# EAGLE design tester (EAGLE 6.4)
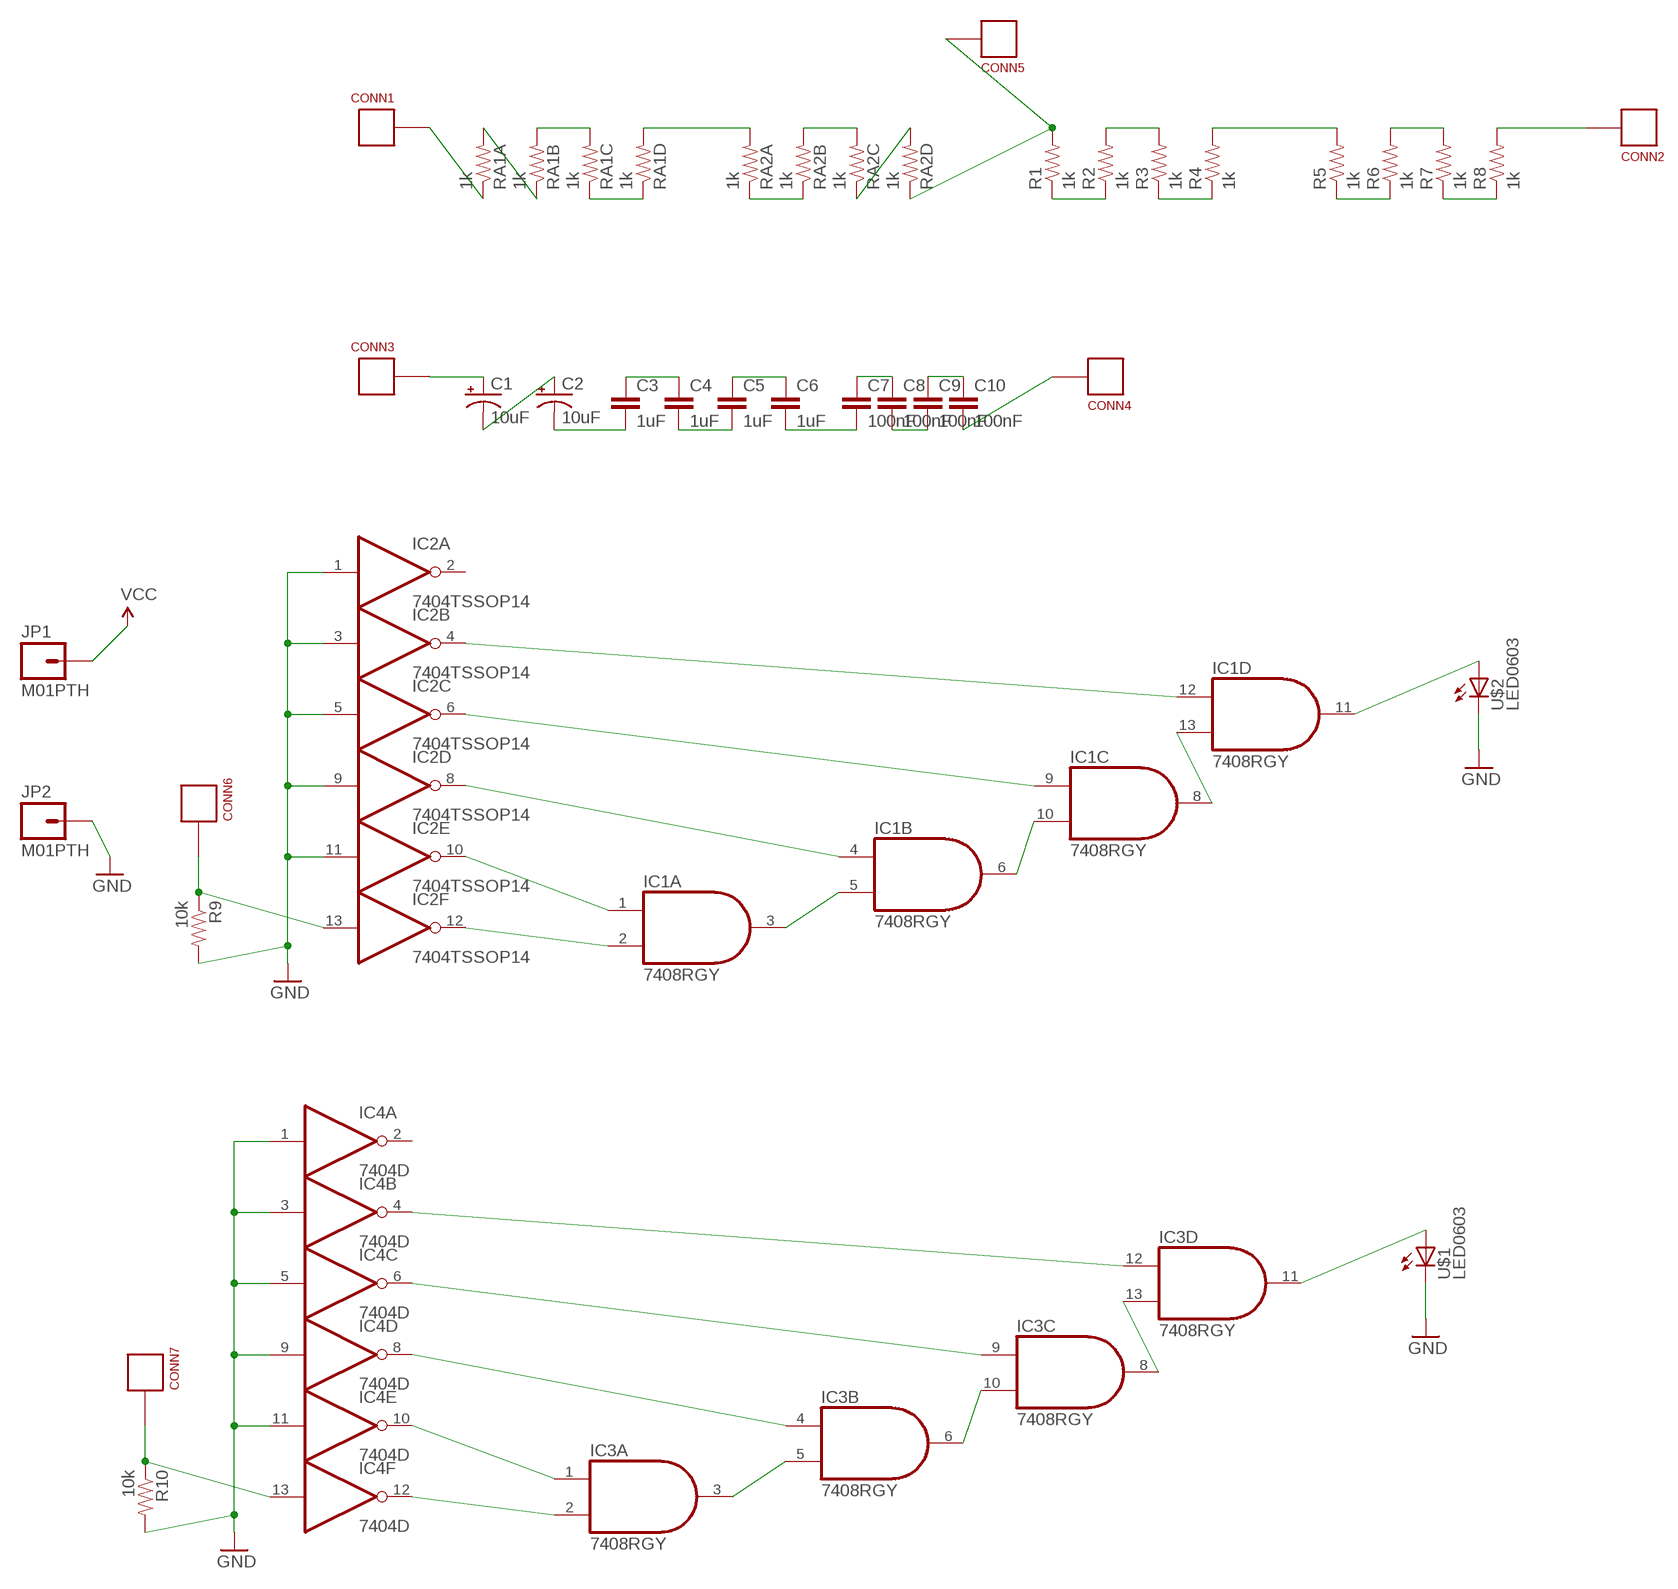
[diagram p0: schematic, sheet 1]

## Parts
C1  10uF  CAP_POL1206  [EIA3216]
C2  10uF  CAP_POL1206  [EIA3216]
C3  1uF  CAP0805  [0805]
C4  1uF  CAP0805  [0805]
C5  1uF  CAP0805  [0805]
C6  1uF  CAP0805  [0805]
C7  100nF  CAP0402-CAP  [0402-CAP]
C8  100nF  CAP0402-CAP  [0402-CAP]
C9  100nF  CAP0402-CAP  [0402-CAP]
C10  100nF  CAP0402-CAP  [0402-CAP]
CONN1  CONNECTOR  [TESTPAD]
CONN2  CONNECTOR  [TESTPAD]
CONN3  CONNECTOR  [TESTPAD]
CONN4  CONNECTOR  [TESTPAD]
CONN5  CONNECTOR  [TESTPAD]
CONN6  CONNECTOR  [TESTPAD]
CONN7  CONNECTOR  [TESTPAD]
IC1  7408RGY  [QFN14]
IC2  7404TSSOP14  [TSSOP14]
IC3  7408RGY  [QFN14]
IC4  7404D  [SO14]
JP1  M01PTH  [1X01]
JP2  M01PTH  [1X01]
R1  1k  RESISTOR0603  [0603-RES]
R2  1k  RESISTOR0603  [0603-RES]
R3  1k  RESISTOR0603  [0603-RES]
R4  1k  RESISTOR0603  [0603-RES]
R5  1k  RESISTOR0402  [0402-RES]
R6  1k  RESISTOR0402  [0402-RES]
R7  1k  RESISTOR0402  [0402-RES]
R8  1k  RESISTOR0402  [0402-RES]
R9  10k  RESISTOR0402  [0402-RES]
R10  10k  RESISTOR0402  [0402-RES]
RA1  1k  RESISTOR_ARRAY0603_X4  [0603-ARV]
RA2  1k  RESISTOR_ARRAY0603_X4  [0603-ARV]
U$1  LED0603  [0603_LED]
U$2  LED0603  [0603_LED]

## Nets
GND: IC2.1(A:I) IC2.3(B:I) IC2.5(C:I) IC2.9(D:I) IC2.11(E:I) IC4.1(A:I) IC4.3(B:I) IC4.5(C:I) IC4.9(D:I) IC4.11(E:I) JP2.1 R9.2 R10.2 U$1.C U$2.C
N$1: RA1.2 RA1.8
N$2: CONN1.P RA1.1
N$3: RA1.6 RA1.7
N$4: RA1.3 RA1.4
N$5: RA1.5 RA2.8
N$6: RA2.1 RA2.2
N$7: RA2.6 RA2.7
N$8: RA2.3 RA2.5
N$9: R1.1 R2.1
N$10: R2.2 R3.2
N$11: R3.1 R4.1
N$12: R4.2 R5.2
N$13: R5.1 R6.1
N$14: R6.2 R7.2
N$15: R7.1 R8.1
N$16: CONN2.P R8.2
N$17: CONN5.P R1.2 RA2.4
N$18: C1.A(+) CONN3.P
N$19: C1.C(-) C2.A(+)
N$20: C2.C(-) C3.2
N$21: C3.1 C4.1
N$22: C4.2 C5.2
N$23: C5.1 C6.1
N$24: C6.2 C7.2
N$25: C8.2 C9.2
N$26: C9.1 C10.1
N$27: C7.1 C8.1
N$28: C10.2 CONN4.P
N$29: IC1.2(A:I1) IC2.12(F:O)
N$30: IC1.1(A:I0) IC2.10(E:O)
N$31: IC1.4(B:I0) IC2.8(D:O)
N$32: IC1.3(A:O) IC1.5(B:I1)
N$33: IC1.6(B:O) IC1.10(C:I1)
N$34: IC1.9(C:I0) IC2.6(C:O)
N$35: IC1.12(D:I0) IC2.4(B:O)
N$36: IC1.8(C:O) IC1.13(D:I1)
N$37: IC1.11(D:O) U$2.A
N$38: IC3.3(A:O) IC3.5(B:I1)
N$39: IC3.6(B:O) IC3.10(C:I1)
N$40: IC3.8(C:O) IC3.13(D:I1)
N$41: IC3.11(D:O) U$1.A
N$42: IC3.2(A:I1) IC4.12(F:O)
N$43: IC3.1(A:I0) IC4.10(E:O)
N$44: IC3.9(C:I0) IC4.6(C:O)
N$45: IC3.4(B:I0) IC4.8(D:O)
N$46: IC3.12(D:I0) IC4.4(B:O)
N$47: CONN6.P IC2.13(F:I) R9.1
N$48: CONN7.P IC4.13(F:I) R10.1
VCC: JP1.1
Unconnected: IC2.2(A:O) IC4.2(A:O)

## Power pins joined to a net without a drawn wire
GND: IC1.7(P:GND) IC2.7(P:GND) IC3.7(P:GND) IC4.7(P:GND)
VCC: IC1.14(P:VCC) IC2.14(P:VCC) IC3.14(P:VCC) IC4.14(P:VCC)

## Library data of the parts
C1 C2 = kmod:CAP_POL: Capacitor Polarized These are standard SMD and PTH capacitors. Normally 10uF, 47uF, and 100uF in electrolytic and tantalum varieties. Always verify the external diameter of the through hole cap, it varies with capacity, voltage, and manufacturer. The EIA devices should be standard.
C3-C10 = SparkFun-Capacitors:CAP: Capacitor Standard 0603 ceramic capacitor, and 0.1" leaded capacitor.
CONN1-CONN7 = kmod:CONNECTOR
IC1 IC3 = kmod:74*08: Quad 2-input AND gate
IC2 IC4 = kmod:74*04: Hex INVERTER
JP1 JP2 = SparkFun-Connectors:M01: Header 1 Standard 1-pin 0.1" header. Use with straight break away headers (SKU : PRT-00116), right angle break away headers (PRT-00553), swiss pins (PRT-00743), machine pins (PRT-00117), and female headers (PRT-00115).
R1-R10 = kmod:RESISTOR: Resistor Basic schematic elements and footprints for 0603, 1206, and PTH resistors.
RA1 RA2 = kmod:RESISTOR_ARRAY
U$1 U$2 = kmod:LED

## Board
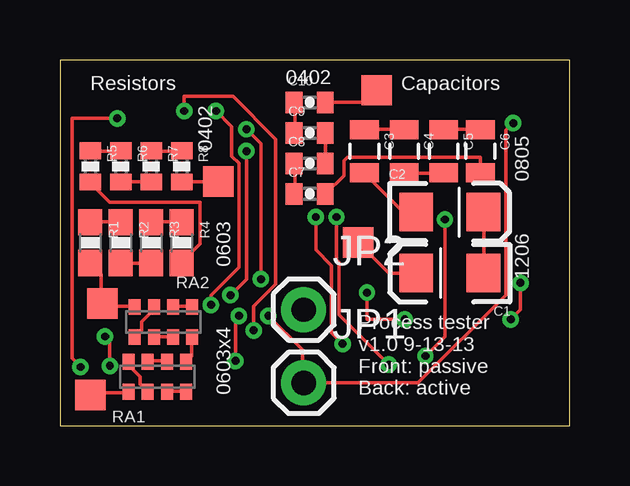
[diagram p1: board, top side]
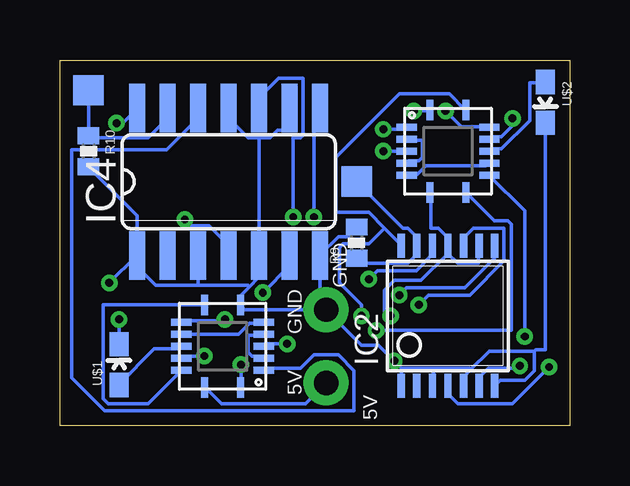
[diagram p2: board, bottom side, seen from below]

Size 21.26 x 15.23 mm. Coordinates in mm from the lower left corner, seen from the top.
Outline: 0,0 21.26,0 21.26,15.23 0,15.23 0,0
Copper layers (1*16): Top 0.0356mm / dielectric 1.5011mm / Bottom 0.0356mm
Design rules "OSHPark_mine": minimum track width 6mil, minimum drill 13mil, track to track 6mil, track to pad 6mil, pad to pad 6mil, via to via 6mil, smd to smd 6mil, copper to edge 15mil, drill to drill 6mil, minimum pad ring 7mil, minimum via ring 7mil, stop-mask expansion 2mil, vias tented up to drill 13mil, thermal gap 10mil

### Footprints (pad centres in the part's own frame; a part is rotated, then mirrored left to right if it is on the bottom)
EIA3216 = smd 1.4 x 1.6: A 1.4,0; C -1.4,0
0805 = smd 0.8 x 1.2: 1 -0.9,0; 2 0.9,0
0402-CAP = smd 0.7 x 0.9: 1 -0.65,0; 2 0.65,0
TESTPAD = smd 1.27 x 1.27: P 0,0
QFN14 = smd 0.85 x 0.28: 1 -1.725,-0.75; 7 1.725,-0.75; 8 1.725,0.75; 14 -1.725,0.75 | smd 0.28 x 0.85: 2 -1,-1.725; 3 -0.5,-1.725; 4 0,-1.725; 5 0.5,-1.725; 6 1,-1.725; 9 1,1.725; 10 0.5,1.725; 11 0,1.725; 12 -0.5,1.725; 13 -1,1.725
TSSOP14 = smd 0.305 x 0.991: 1 -1.95,-2.918; 2 -1.3,-2.918; 3 -0.65,-2.918; 4 0,-2.918; 5 0.65,-2.918; 6 1.3,-2.918; 7 1.95,-2.918; 8 1.95,2.918; 9 1.3,2.918; 10 0.65,2.918; 11 0,2.918; 12 -0.65,2.918; 13 -1.3,2.918; 14 -1.95,2.918
SO14 = smd 0.66 x 2.032: 1 -3.81,-3.073; 2 -2.54,-3.073; 3 -1.27,-3.073; 4 0,-3.073; 5 1.27,-3.073; 6 2.54,-3.073; 7 3.81,-3.073; 8 3.81,3.073; 9 2.54,3.073; 10 1.27,3.073; 11 0,3.073; 12 -1.27,3.073; 13 -2.54,3.073; 14 -3.81,3.073
1X01 = drill 1.016 pad 1.88: 1 0,0
0603-RES = smd 1.1 x 1: 1 -0.85,0; 2 0.85,0
0402-RES = smd 0.7 x 0.9: 1 -0.65,0; 2 0.65,0
0603-ARV = smd 0.5 x 0.65: 1 -1.2,-0.625; 2 -0.4,-0.625; 3 0.4,-0.625; 4 1.2,-0.625; 5 1.2,0.625; 6 0.4,0.625; 7 -0.4,0.625; 8 -1.2,0.625
0603_LED = smd 0.8 x 1.003: A 0,-0.852; C 0,0.852

### Placement (x,y rotation side)
C1  16.26,6.35 180 top
C2  16.26,8.89 0 top
C3  12.7,11.43 270 top
C4  14.35,11.43 270 top
C5  16,11.43 270 top
C6  17.53,11.43 270 top
C7  10.41,9.65 0 top
C8  10.41,10.92 0 top
C9  10.41,12.19 0 top
C10  10.41,13.46 0 top
CONN1  1.27,1.27 0 top
CONN2  6.6,10.16 0 top
CONN3  12.45,7.62 0 top
CONN4  13.21,13.97 270 top
CONN5  1.78,5.08 0 top
CONN6  8.89,10.16 0 bottom
CONN7  20.07,13.97 0 bottom
IC1  5.08,11.43 270 bottom
IC2  5.08,4.57 0 bottom
IC3  14.48,3.3 90 bottom
IC4  14.22,10.16 0 bottom
JP1  10.16,1.78 0 top
JP2  10.16,4.83 0 top
R1  1.27,7.62 270 top
R2  2.54,7.62 270 top
R3  3.81,7.62 270 top
R4  5.08,7.62 270 top
R5  1.27,10.79 270 top
R6  2.54,10.79 270 top
R7  3.81,10.79 270 top
R8  5.08,10.79 270 top
R9  8.89,7.62 90 bottom
R10  20.07,11.43 270 bottom
RA1  4.06,2.03 0 top
RA2  4.32,4.32 180 top
U$1  18.8,2.54 0 bottom
U$2  1.02,13.46 180 bottom

### Tracks (layer width: path | path; a pad name or v marks a point on that pad's centre or on a via)
GND  (via drill 0.33)
  Top 0.152: v7.47,4.57 7.32,4.42 v7.32,2.69 | v18.8,4.42 19.2,4.83 v19.2,5.94
  Bottom 0.152: IC2.11 5.08,7.82 5.49,8.23 5.79,8.23 5.79,9.7 IC1.7 | IC2.11 5.08,7.16 4.67,6.76 3.81,6.76 3.81,7.47 IC2.9 | 1.47,3.1 1.47,2.29 1.88,1.88 2.9,1.88 3.1,1.68 IC2.7 | 1.47,3.1 3.35,3.1 4.12,2.34 | 4.12,2.34 4.42,2.03 4.42,1.68 IC2.5 | 5.69,2.39 5.69,1.68 IC2.3 | 5.69,2.39 4.17,2.39 4.12,2.34 | 7.01,2.39 7.01,1.68 IC2.1 | 5.69,2.39 7.01,2.39 | U$2.C 1.02,3.15 1.42,3.15 1.47,3.1 | v7.47,4.57 7.72,4.57 7.72,5.64 7.32,6.04 6.2,6.04 5.13,7.11 IC2.11 | 7.01,2.39 v7.32,2.69 7.98,3.35 8.69,3.35 JP2.1 | IC4.1 18.03,8.74 R10.2 | v18.8,4.42 U$1.C | v19.2,5.94 18.09,7.06 IC4.1 | IC4.9 11.68,12.29 12.19,12.29 12.5,11.99 12.95,11.99 | 12.95,11.99 13.41,11.99 14.22,12.8 IC4.11 | R9.2 8.89,8.23 9.25,7.87 9.65,7.87 10.41,7.11 IC4.7 10.41,4.88 JP2.1 | JP2.1 13.56,4.83 13.72,4.98 IC3.7 13.72,5.08 13.72,5.44 13.36,5.79 | 13.36,5.79 13.01,6.15 12.95,6.15 IC4.5 12.95,11.99 | 15.49,5.84 IC4.3 | 15.49,5.84 13.41,5.84 13.36,5.79 | 15.49,5.84 17.27,5.84 18.24,6.81 IC4.1
N$1
  Top 0.152: RA1.2 3.66,1.42 3.35,1.73 3.35,2.03 2.9,2.49 2.9,2.64 RA1.8
N$2
  Top 0.152: CONN1.P 1.27,1.37 2.85,1.37 RA1.1
N$3
  Top 0.152: RA1.7 3.71,2.69 4.42,2.69 RA1.6
N$4
  Top 0.152: RA1.3 4.47,1.42 5.23,1.42 RA1.4
N$5
  Top 0.152: RA1.5 5.28,2.69 5.49,2.9 5.49,3.66 RA2.8
N$6
  Top 0.152: RA2.2 4.72,4.98 5.49,4.98 RA2.1
N$7
  Top 0.152: RA2.6 3.96,3.71 4.67,3.71 RA2.7
N$8
  Top 0.152: RA2.5 3.15,3.71 3.4,3.96 3.4,4.32 3.91,4.83 3.91,4.93 RA2.3
N$9
  Top 0.152: R1.1 1.27,8.48 2.54,8.48 R2.1
N$10
  Top 0.152: R2.2 2.54,6.76 3.81,6.76 R3.2
N$11
  Top 0.152: R3.1 3.81,8.48 5.08,8.48 R4.1
N$12
  Top 0.152: R5.2 1.27,10.11 2.08,9.3 5.84,9.3 5.84,7.57 5.08,6.81 R4.2
N$13
  Top 0.152: R5.1 1.27,11.43 2.54,11.43 R6.1
N$14
  Top 0.152: R6.2 2.54,10.16 3.81,10.16 R7.2
N$15
  Top 0.152: R7.1 3.81,11.43 5.08,11.43 R8.1
N$16
  Top 0.152: CONN2.P 5.08,10.16 R8.2
N$17
  Top 0.152: RA2.4 3.1,4.98 1.78,4.98 CONN5.P 1.73,5.13 1.73,6.3 1.27,6.76 R1.2
N$18
  Top 0.152: CONN3.P 13.72,6.35 C1.A
N$19
  Top 0.152: C1.C 17.68,6.35 17.68,8.89 C2.A
N$20
  Top 0.152: C2.C 14.33,8.89 12.7,10.52 C3.2
N$21
  Top 0.152: C3.1 12.7,12.34 14.33,12.34 C4.1
N$22
  Top 0.152: C4.2 14.38,10.52 16,10.52 C5.2
N$23
  Top 0.152: C5.1 16,12.34 17.53,12.34 C6.1
N$24
  Top 0.152: C6.2 17.53,11.18 11.99,11.18 11.84,11.02 11.84,10.41 11.07,9.65 C7.2
N$25
  Top 0.152: C8.2 11.07,10.92 11.07,12.19 C9.2
N$26
  Top 0.152: C9.1 9.8,12.19 9.8,13.46 C10.1
N$27
  Top 0.152: C7.1 9.8,9.65 9.8,10.92 C8.1
N$28
  Top 0.152: C10.2 13.21,13.46 CONN4.P
N$29  (via drill 0.33)
  Top 0.152: v7.77,12.34 8.38,11.73 v8.38,6.1
  Bottom 0.152: v7.77,12.34 6.86,12.34 6.81,12.39 IC1.2 | v8.38,6.1 8.03,6.45 6.4,6.45 5.74,7.11 5.74,7.47 IC2.12
N$30  (via drill 0.33)
  Top 0.152: v6.5,13.11 7.16,12.45 7.16,11.23 7.47,10.92 7.47,6.6 6.3,5.44 v6.3,5.03
  Bottom 0.152: v6.5,13.11 5.84,13.11 IC1.1 | v6.3,5.03 5.89,5.44 4.17,5.44 2.74,6.86 2.74,8.23 4.01,8.23 4.42,7.82 4.42,7.52 IC2.10
N$31  (via drill 0.33)
  Top 0.152: v7.77,11.43 7.77,6.1 v7.11,5.44
  Bottom 0.152: v7.77,11.43 IC1.4 | v7.11,5.44 6.81,5.74 4.37,5.74 3.15,6.96 3.15,7.47 IC2.8
N$32
  Bottom 0.152: IC1.5 6.76,10.97 6.71,11.02 6.3,11.02 6.15,11.18 6.15,11.89 6.76,11.89 IC1.3
N$33
  Bottom 0.152: IC1.10 3.4,10.92 3.5,10.82 5.99,10.82 6.35,10.46 6.76,10.46 IC1.6
N$34  (via drill 0.33)
  Top 0.152: v1.88,3.71 2.08,3.5 v2.08,2.49
  Bottom 0.152: v1.88,3.71 1.88,8.94 3.35,10.41 IC1.9 | v2.08,2.49 2.18,2.39 3.4,2.39 3.76,2.03 3.76,1.68 IC2.6
N$35  (via drill 0.33)
  Top 0.152: v2.39,12.8 0.51,12.8 0.51,2.79 v0.86,2.44
  Bottom 0.152: v2.39,12.8 2.39,12.5 2.85,12.04 3.25,12.04 IC1.12 | v0.86,2.44 2.39,0.91 4.67,0.91 5.08,1.32 IC2.4
N$36  (via drill 0.33)
  Top 0.152: v8.08,3.96 8.08,4.98 8.99,5.89 8.99,11.94 7.21,13.72 5.18,13.72 v5.18,13.11
  Bottom 0.152: v8.08,3.96 2.44,3.96 2.44,8.38 2.59,8.53 3.15,8.53 4.32,9.7 IC1.8 | v5.18,13.11 4.52,12.45 3.4,12.45 IC1.13
N$37
  Bottom 0.152: IC1.11 3.25,11.53 2.85,11.53 1.68,12.7 1.68,14.28 1.02,14.28 U$2.A
N$38
  Bottom 0.152: IC3.3 12.8,2.85 12.85,2.9 13.26,2.9 13.41,3.05 13.41,3.76 12.8,3.76 IC3.5
N$39
  Bottom 0.152: IC3.10 16.15,3.81 13.82,3.81 13.36,4.27 12.8,4.27 IC3.6
N$40
  Bottom 0.152: IC3.13 16.2,2.29 17.58,0.91 19.25,0.91 19.46,1.12 19.46,5.03 IC3.8
N$41
  Bottom 0.152: IC3.11 16.31,3.2 17.32,3.2 18.8,1.73 U$1.A
N$42
  Bottom 0.152: IC4.12 15.49,12.8 16.82,11.48 20.78,11.48 20.78,1.98 19.41,0.61 8.99,0.61 8.99,2.29 9.65,2.95 10.67,2.95 11.23,2.39 12.7,2.39 12.75,2.34 IC3.2
N$43  (via drill 0.33)
  Top 0.152: v13.72,2.54 11.63,4.62 11.63,6.81 11.53,6.91 v11.53,8.69
  Bottom 0.152: v13.72,2.54 13.72,1.63 IC3.1 | v11.53,8.69 11.53,11.99 11.23,11.99 11.12,12.09 11.12,14.48 12.14,14.48 12.95,13.66 IC4.10
N$44  (via drill 0.33)
  Top 0.152: v14.38,4.42 12.8,4.42 v12.8,5.54
  Bottom 0.152: v14.38,4.42 14.43,4.37 16.1,4.37 16.15,4.32 IC3.9 | v12.8,5.54 11.68,6.66 IC4.6
N$45  (via drill 0.33)
  Top 0.152: v11.79,3.4 11.33,3.86 11.33,6.66 10.67,7.32 v10.67,8.69
  Bottom 0.152: v11.79,3.4 12.65,3.4 IC3.4 | v10.67,8.69 10.67,13.21 10.41,13.21 IC4.8
N$46  (via drill 0.33)
  Top 0.152: v15.24,2.9 16.05,3.71 v16.05,8.59
  Bottom 0.152: v15.24,2.9 16.1,2.9 16.15,2.85 IC3.12 | v16.05,8.59 15.8,8.33 15.04,8.33 14.22,7.52 IC4.4
N$47
  Bottom 0.152: R9.1 8.69,6.76 6.76,6.76 6.4,7.11 6.4,7.47 IC2.13 6.45,7.52 6.45,7.92 6.76,8.23 6.96,8.23 CONN6.P
N$48
  Bottom 0.152: CONN7.P R10.1 20.02,12.04 19.96,11.99 17.58,11.99 16.76,12.8 IC4.13
VCC  (via drill 0.33)
  Top 0.152: v18.9,12.6 18.59,12.29 18.59,5.44 14.94,1.78 JP1.1 10.11,1.83 10.11,3.15 v8.69,4.57
  Bottom 0.152: 7.72,8.23 7.01,7.52 IC2.14 | 7.72,8.23 8.38,8.89 9.75,8.89 9.75,11.18 7.11,13.82 5.03,13.82 4.37,13.16 IC1.14 | JP1.1 11.02,0.91 14.53,0.91 15.19,1.57 IC3.14 | v18.9,12.6 18.64,12.6 18.03,13.21 IC4.14 | 7.72,8.23 8.38,7.57 9.45,7.57 9.6,7.42 9.6,5.94 8.69,5.03 v8.69,4.57

### Text on the board
tPlace: Resistors | 0402 | Capacitors | 0402 | 0805 | 0603 | 1206 | 0603x4 | Process tester / v1.0 9-13-13 / Front: passive / Back: active
bPlace: GND | GND | 5V | 5V